# EAGLE design Gondola_Sail_electronics_M4_minimal (EAGLE 9.3.0)
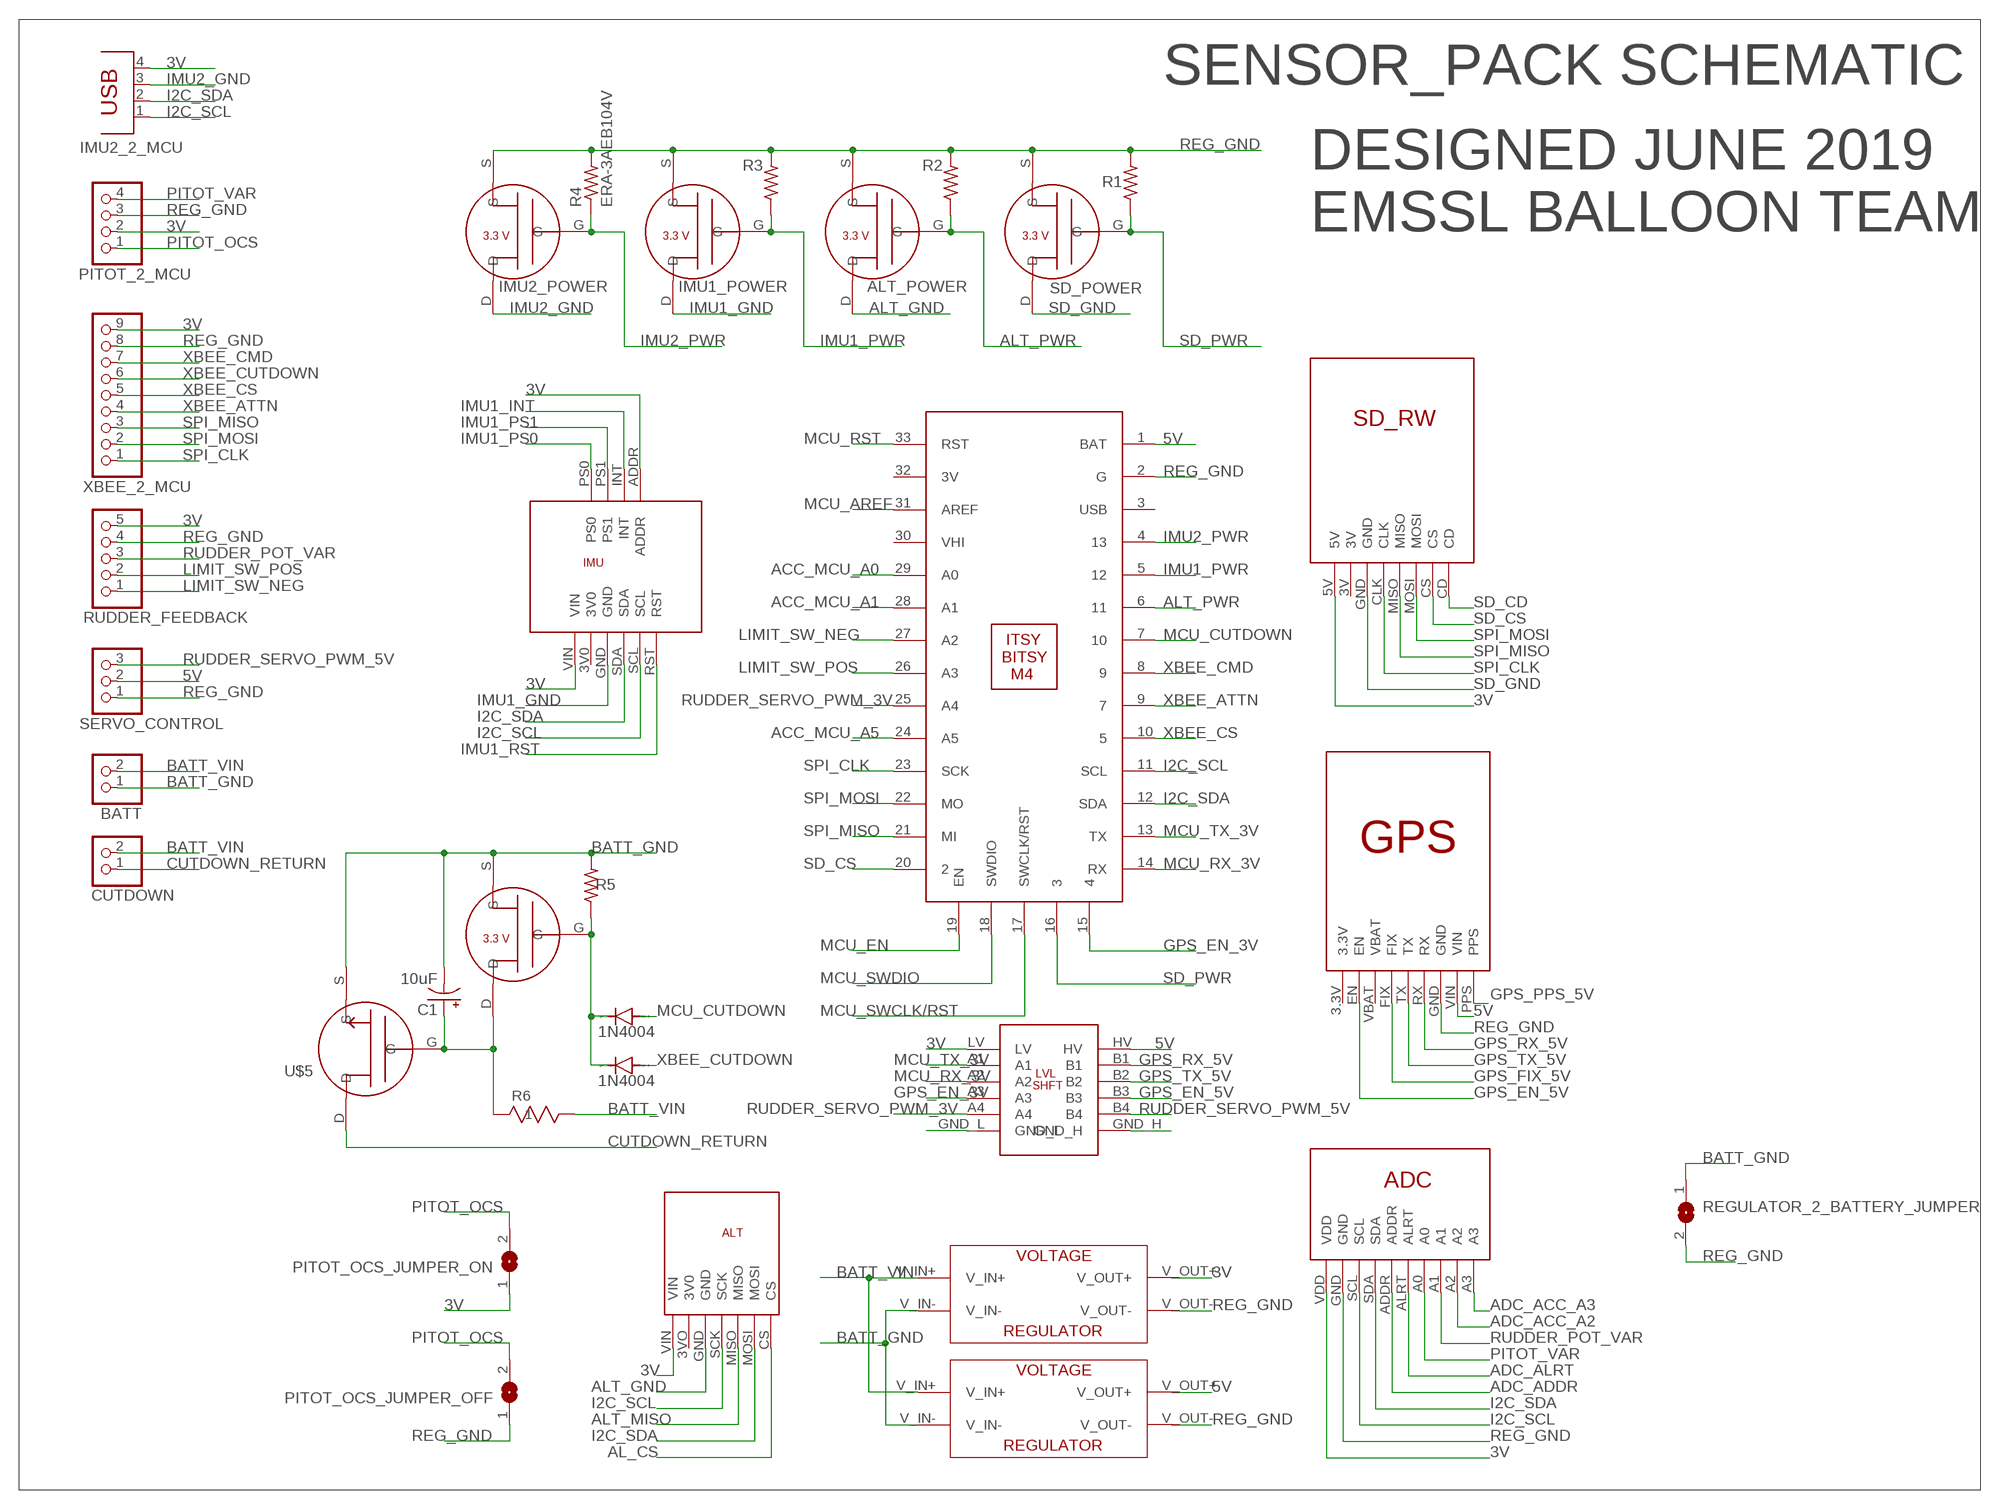
[diagram p0: schematic, sheet 1]

## Parts
3V_REG  3V/5V_REGULATOR  [5V/3V_REGULATOR]
5V_REG  3V/5V_REGULATOR  [5V/3V_REGULATOR]
ALT_POWER  3.3V_NCH_FET  [3.3VTRANSISTOR]
BATT  PINHD-1X2/90  [1X02/90]
C1  10uF  10UF-POLAR-RADIAL-2.5MM-25V-20%  [CPOL-RADIAL-2.5MM-5MM]
CUTDOWN  PINHD-1X2/90  [1X02/90]
D1  1N4004  [DO41-10]
D2  1N4004  [DO41-10]
IMU1  BNO055  [BNO055]
IMU1_POWER  3.3V_NCH_FET  [3.3VTRANSISTOR]
IMU2_2_MCU  PN87520  [PN87520]
IMU2_POWER  3.3V_NCH_FET  [3.3VTRANSISTOR]
PITOT_2_MCU  PINHD-1X4/90  [1X04/90]
PITOT_OCS_JUMPER_OFF  SJ  [SJ]
PITOT_OCS_JUMPER_ON  SJ  [SJ]
R1  ERA-3AEB104V  [RESC1608X55]
R2  ERA-3AEB104V  [RESC1608X55]
R3  ERA-3AEB104V  [RESC1608X55]
R4  ERA-3AEB104V  [RESC1608X55]
R5  ERA-3AEB104V  [RESC1608X55]
R6  RR0816P-103-D  [RES_0816]
REGULATOR_2_BATTERY_JUMPER  SJW  [SJW]
RUDDER_FEEDBACK  PINHD-1X5/90  [1X05/90]
SD_POWER  3.3V_NCH_FET  [3.3VTRANSISTOR]
SD_POWER1  3.3V_NCH_FET  [3.3VTRANSISTOR]
SERVO_CONTROL  PINHD-1X3/90  [1X03/90]
U$1  ADAFRUIT_GPS  [ADAFRUIT_GPS]
U$2  ADAFRUI_SD_RW  [ADAFRUIT_SD_RW]
U$3  ADS1115  [ADS1115]
U$4  BME280  [BME280]
U$5  CUTDOWN_POWER_TRANSISTOR  [T03B]
U$6  BSS138_LVLSHIFT  [BSS138_LEVELSHIFT]
U$8  ITSY_BITSY_M4  [ITSY_BITSY_M4]
XBEE_2_MCU  PINHD-1X9/90  [1X09/90]

## Nets
3V: 3V_REG.V_OUT+ IMU1.ADDR IMU1.VIN IMU2_2_MCU.4 PITOT_2_MCU.2 PITOT_OCS_JUMPER_ON.1 RUDDER_FEEDBACK.5 U$2.5V U$3.VDD U$4.VIN U$6.LV XBEE_2_MCU.9
5V: 5V_REG.V_OUT+ SERVO_CONTROL.2 U$1.VIN U$6.HV U$8.1(BAT)
ACC_MCU_A0: U$8.29(A0)
ACC_MCU_A1: U$8.28(A1)
ACC_MCU_A5: U$8.24(A5)
ADC_ACC_A2: U$3.A2
ADC_ACC_A3: U$3.A3
ADC_ADDR: U$3.ADDR
ADC_ALRT: U$3.ALRT
AL_CS: U$4.CS
ALT_GND: ALT_POWER.D U$4.GND
ALT_MISO: U$4.MISO
ALT_PWR: ALT_POWER.G R2.1 U$8.6
BATT_GND: 3V_REG.V_IN- 5V_REG.V_IN- BATT.1 C1.2(-) R5.2 REGULATOR_2_BATTERY_JUMPER.1 SD_POWER1.S U$5.S
BATT_VIN: 3V_REG.V_IN+ 5V_REG.V_IN+ BATT.2 CUTDOWN.2 R6.2
CUTDOWN: D1.C D2.C R5.1 SD_POWER1.G
CUTDOWN_RETURN: CUTDOWN.1 U$5.D
GPS_EN_3V: U$6.A3 U$8.15
GPS_EN_5V: U$1.EN U$6.B3
GPS_FIX_5V: U$1.FIX
GPS_PPS_5V: U$1.PPS
GPS_RX_5V: U$1.RX U$6.B1
GPS_TX_5V: U$1.TX U$6.B2
I2C_SCL: IMU1.SCL IMU2_2_MCU.1 U$3.SCL U$4.SCK U$8.11(SCL)
I2C_SDA: IMU1.SDA IMU2_2_MCU.2 U$3.SDA U$4.MOSI U$8.12(SDA)
IMU1_GND: IMU1.GND IMU1_POWER.D
IMU1_INT: IMU1.INT
IMU1_PS0: IMU1.PS0
IMU1_PS1: IMU1.PS1
IMU1_PWR: IMU1_POWER.G R3.1 U$8.5
IMU1_RST: IMU1.RST
IMU2_GND: IMU2_2_MCU.3 IMU2_POWER.D
IMU2_PWR: IMU2_POWER.G R4.1 U$8.4
LIMIT_SW_NEG: RUDDER_FEEDBACK.1 U$8.27(A2)
LIMIT_SW_POS: RUDDER_FEEDBACK.2 U$8.26(A3)
MCU_AREF: U$8.31(AREF)
MCU_CUTDOWN: D1.A U$8.7
MCU_EN: U$8.19(EN)
MCU_RST: U$8.33(RST)
MCU_RX_3V: U$6.A2 U$8.14(RX)
MCU_SWCLK/RST: U$8.17(SWCLK/RST)
MCU_SWDIO: U$8.18(SWDIO)
MCU_TX_3V: U$6.A1 U$8.13(TX)
N$1: U$6.GND_L
N$2: U$6.GND_H
N$5: C1.1(+) R6.1 SD_POWER1.D U$5.G
PITOT_OCS: PITOT_2_MCU.1 PITOT_OCS_JUMPER_OFF.2 PITOT_OCS_JUMPER_ON.2
PITOT_VAR: PITOT_2_MCU.4 U$3.A0
REG_GND: 3V_REG.V_OUT- 5V_REG.V_OUT- ALT_POWER.S IMU1_POWER.S IMU2_POWER.S PITOT_2_MCU.3 PITOT_OCS_JUMPER_OFF.1 R1.2 R2.2 R3.2 R4.2 REGULATOR_2_BATTERY_JUMPER.2 RUDDER_FEEDBACK.4 SD_POWER.S SERVO_CONTROL.1 U$1.GND U$3.GND U$8.2(G) XBEE_2_MCU.8
RUDDER_POT_VAR: RUDDER_FEEDBACK.3 U$3.A1
RUDDER_SERVO_PWM_3V: U$6.A4 U$8.25(A4)
RUDDER_SERVO_PWM_5V: SERVO_CONTROL.3 U$6.B4
SD_CD: U$2.CD
SD_CS: U$2.CS U$8.20
SD_GND: SD_POWER.D U$2.GND
SD_PWR: R1.1 SD_POWER.G U$8.16
SPI_CLK: U$2.CLK U$8.23(SCK) XBEE_2_MCU.1
SPI_MISO: U$2.MISO U$8.21(MI) XBEE_2_MCU.3
SPI_MOSI: U$2.MOSI U$8.22(MO) XBEE_2_MCU.2
XBEE_ATTN: U$8.9 XBEE_2_MCU.4
XBEE_CMD: U$8.8 XBEE_2_MCU.7
XBEE_CS: U$8.10 XBEE_2_MCU.5
XBEE_CUTDOWN: D2.A XBEE_2_MCU.6
Unconnected: IMU1.3V0 U$1.3.3V U$1.VBAT U$2.3V U$4.3VO(3V0) U$8.3(USB) U$8.30(VHI) U$8.32(3V)

## Notes on the sheet
- SENSOR_PACK SCHEMATIC
- DESIGNED JUNE 2019
  EMSSL BALLOON TEAM

## Library data of the parts
3V_REG 5V_REG = Adafruit_Arduino:3V/5V_REGULATOR
ALT_POWER IMU1_POWER IMU2_POWER SD_POWER SD_POWER1 = Adafruit_Arduino:3.3V_NCH_FET
BATT CUTDOWN = pinhead:PINHD-1X2: PIN HEADER
C1 = SparkFun-Capacitors:10UF-POLAR: 10.0µF polarized capacitors A capacitor is a passive two-terminal electrical component used to store electrical energy temporarily in an electric field.; PROD_ID: CAP-08440
D1 D2 = diode:1N4004: DIODE general purpose rectifier, 1 A
IMU1 = Adafruit_Arduino:BNO055
IMU2_2_MCU = con-berg:PN87520: BERG USB connector; OC_FARNELL: unknown; OC_NEWARK: unknown
PITOT_2_MCU = pinhead:PINHD-1X4: PIN HEADER
PITOT_OCS_JUMPER_OFF PITOT_OCS_JUMPER_ON REGULATOR_2_BATTERY_JUMPER = jumper:SJ: SMD solder JUMPER
R1-R5 = ERA-3AEB104V:ERA-3AEB104V: METAL FILM RESISTOR, 100KOHM, 100mW, 0.1%; DESCRIPTION: Res Thin Film 0603 100K Ohm 0.1% 0.1W_1/10W_ Ø¢±25ppm/Ø¢°C Molded SMD Automotive Punched T/R; DIGI-KEY_PART_NUMBER: P100KDBCT-ND; DIGI-KEY_PURCHASE_URL: https://www.digikey.com/product-detail/en/panasonic-electronic-components/ERA-3AEB104V/P100KDBCT-ND/1466100?utm_source=snapeda&utm_medium=aggregator&utm_campaign=symbol; MF: Panasonic; MP: ERA-3AEB104V; PACKAGE: 0603 Panasonic
R6 = 10K_SMD_resistors_RR0816p-103-D:RR0816P-103-D; MANUFACTURER_PART_NUMBER: RR0816P103D; VENDOR: Susumu
RUDDER_FEEDBACK = pinhead:PINHD-1X5: PIN HEADER
SERVO_CONTROL = pinhead:PINHD-1X3: PIN HEADER
U$1 = Adafruit_Arduino:ADAFRUIT_GPS
U$2 = Adafruit_Arduino:ADAFRUI_SD_RW
U$3 = Adafruit_Arduino:ADS1115
U$4 = Adafruit_Arduino:BME280
U$5 = Ultrasonic Misc PieceParts:CUTDOWN_POWER_TRANSISTOR
U$6 = Adafruit_Arduino:BSS138_LVLSHIFT
U$8 = Adafruit_Arduino:ITSY_BITSY_M4
XBEE_2_MCU = pinhead:PINHD-1X9: PIN HEADER

## Board
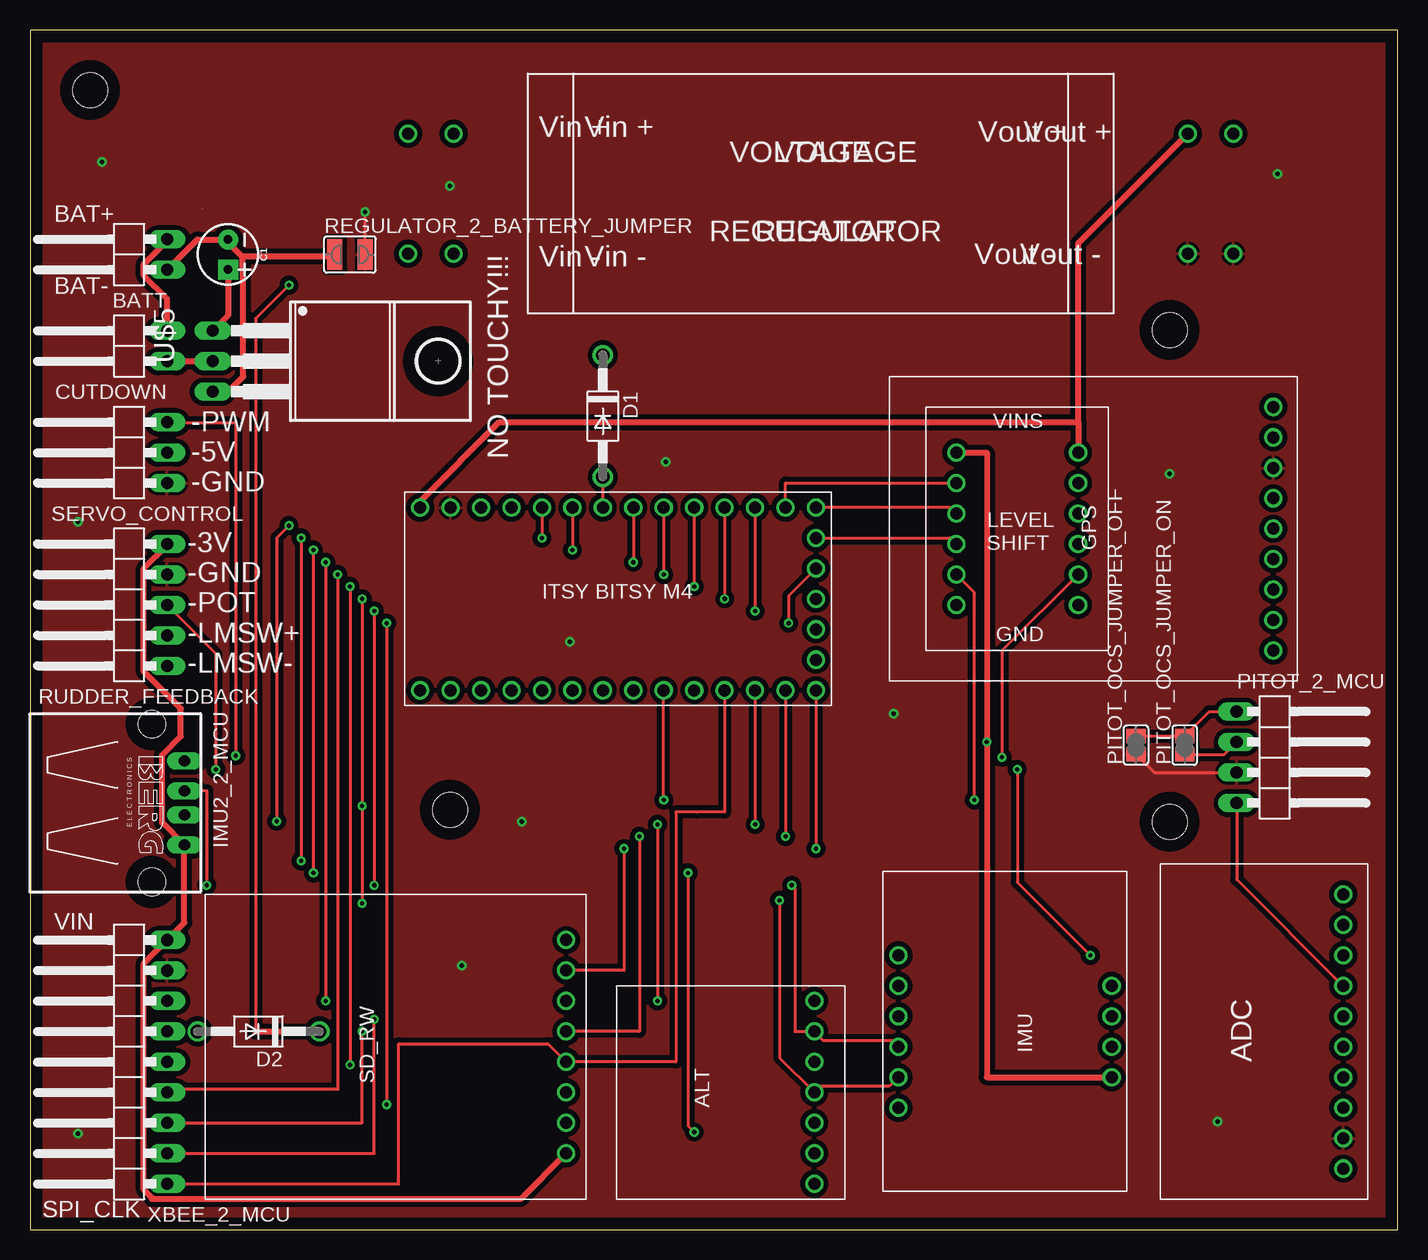
[diagram p1: board, top side]
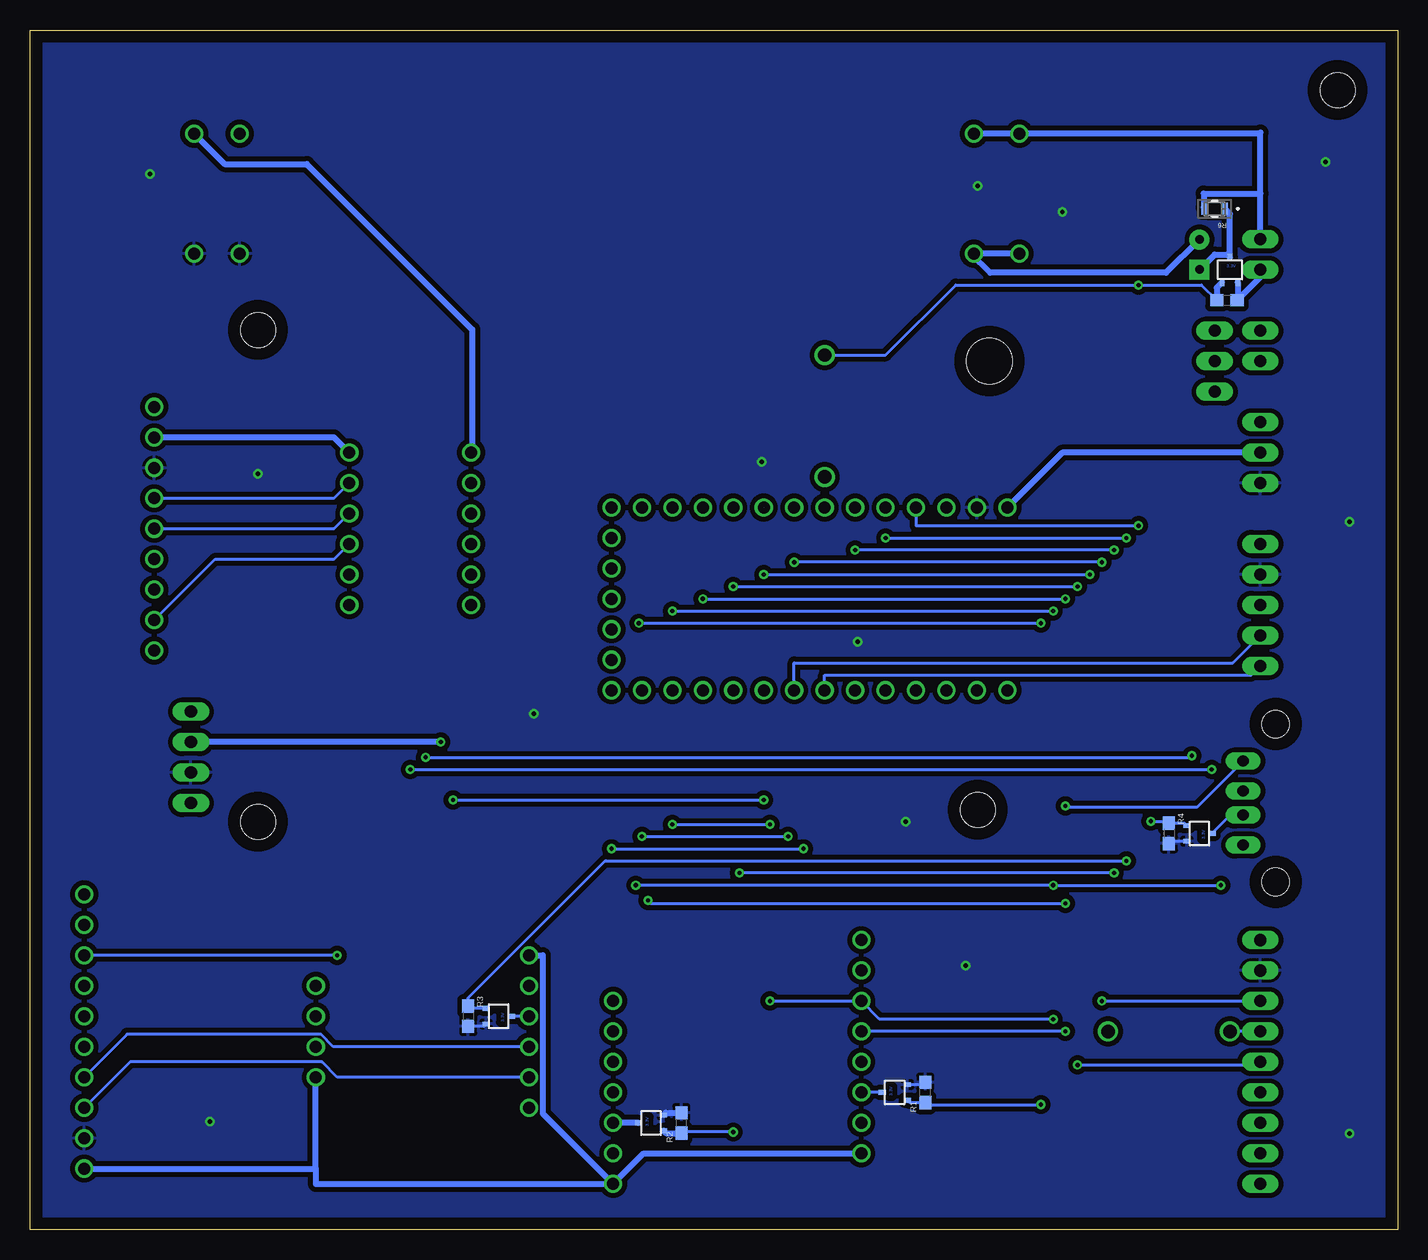
[diagram p2: board, bottom side, seen from below]

Size 114 x 100 mm. Coordinates in mm from the lower left corner, seen from the top.
Outline: 0,0 114,0 114,100 0,100 0,0
Copper layers (1*16): Top 0.035mm / dielectric 1.5mm / Bottom 0.035mm
Design rules "default": minimum track width 6mil, minimum drill 0.35mm, track to track 6mil, track to pad 6mil, pad to pad 6mil, via to via 6mil, smd to smd 6mil, copper to edge 40mil, drill to drill 6mil, minimum pad ring 10mil, minimum via ring 8mil, stop-mask expansion 4mil, vias tented up to drill 0mil, thermal gap 10mil
Holes 2.9 mm at 5,95 95,75 35,35 95,34

### Footprints (pad centres in the part's own frame; a part is rotated, then mirrored left to right if it is on the bottom)
5V/3V_REGULATOR = drill 1: V_IN+ -32.5,5; V_IN- -32.5,-5; V_OUT+ 32.5,5; V_OUT- 32.5,-5
3.3VTRANSISTOR = smd 0.4 x 0.6: D 0,1.05; G -0.65,-1.05; S 0.65,-1.05
1X02/90 = drill 1.016 long: 1 -1.27,-3.81; 2 1.27,-3.81
CPOL-RADIAL-2.5MM-5MM = drill 0.7 pad 1.651 square: 1 1.25,0 | drill 0.7 pad 1.651: 2 -1.25,0
DO41-10 = drill 1.118: A 5.08,0; C -5.08,0
BNO055 = drill 1: 3V0 -3.81,-8.89; ADDR 3.81,8.89; GND -1.27,-8.89; INT 1.27,8.89; PS0 -3.81,8.89; PS1 -1.27,8.89; RST 6.35,-8.89; SCL 3.81,-8.89; SDA 1.27,-8.89; VIN -6.35,-8.89
PN87520 = drill 0.95 long: 1 -3.5,2.71; 2 -1,2.71; 3 1,2.71; 4 3.5,2.71 | hole 2.3: -6.57,0; 6.57,0
1X04/90 = drill 1.016 long: 1 -3.81,-3.81; 2 -1.27,-3.81; 3 1.27,-3.81; 4 3.81,-3.81
SJ = smd 1.168 x 1.6: 1 -0.762,0; 2 0.762,0
RESC1608X55 = smd 1.1 x 1: 1 -0.85,0; 2 0.85,0
RES_0816 = smd 0.553 x 1: 1 -0.827,0; 2 0.827,0
SJW = smd 1.27 x 2.54: 1 -1.27,0; 2 1.27,0
1X05/90 = drill 1.016 long: 1 -5.08,-3.81; 2 -2.54,-3.81; 3 0,-3.81; 4 2.54,-3.81; 5 5.08,-3.81
1X03/90 = drill 1.016 long: 1 -2.54,-3.81; 2 0,-3.81; 3 2.54,-3.81
ADAFRUIT_GPS = drill 1: 3.3V -10.16,-14.986; EN -7.62,-14.986; FIX -2.54,-14.986; GND 5.08,-14.986; PPS 10.16,-14.986; RX 2.54,-14.986; TX 0,-14.986; VBAT -5.08,-14.986; VIN 7.62,-14.986
ADAFRUIT_SD_RW = drill 1: 3V -6.35,-14.224; 5V -8.89,-14.224; CD 8.89,-14.224; CLK -1.27,-14.224; CS 6.35,-14.224; GND -3.81,-14.224; MISO 1.27,-14.224; MOSI 3.81,-14.224
ADS1115 = drill 1: A0 3.81,-6.604; A1 6.35,-6.604; A2 8.89,-6.604; A3 11.43,-6.604; ADDR -1.27,-6.604; ALRT 1.27,-6.604; GND -8.89,-6.604; SCL -6.35,-6.604; SDA -3.81,-6.604; VDD -11.43,-6.604
BME280 = drill 1: 3VO -5.08,-6.96; CS 7.62,-6.96; GND -2.54,-6.96; MISO 2.54,-6.96; MOSI 5.08,-6.96; SCK 0,-6.96; VIN -7.62,-6.96
T03B = drill 1.016 long: D 0,-11.43; G -2.54,-11.43; S 2.54,-11.43 | hole 3.81: 0,7.366
BSS138_LEVELSHIFT = drill 1: A1 -5.08,3.81; A2 -5.08,1.27; A3 -5.08,-1.27; A4 -5.08,-3.81; B1 5.08,3.81; B2 5.08,1.27; B3 5.08,-1.27; B4 5.08,-3.81; GND_H 5.08,-6.35; GND_L -5.08,-6.35; HV 5.08,6.35; LV -5.08,6.35
ITSY_BITSY_M4 = drill 1: 1 -16.51,7.62; 2 -13.97,7.62; 3 -11.43,7.62; 4 -8.89,7.62; 5 -6.35,7.62; 6 -3.81,7.62; 7 -1.27,7.62; 8 1.27,7.62; 9 3.81,7.62; 10 6.35,7.62; 11 8.89,7.62; 12 11.43,7.62; 13 13.97,7.62; 14 16.51,7.62; 15 16.51,5.08; 16 16.51,2.54; 17 16.51,0; 18 16.51,-2.54; 19 16.51,-5.08; 20 16.51,-7.62; 21 13.97,-7.62; 22 11.43,-7.62; 23 8.89,-7.62; 24 6.35,-7.62; 25 3.81,-7.62; 26 1.27,-7.62; 27 -1.27,-7.62; 28 -3.81,-7.62; 29 -6.35,-7.62; 30 -8.89,-7.62; 31 -11.43,-7.62; 32 -13.97,-7.62; 33 -16.51,-7.62
1X09/90 = drill 1.016 long: 1 -10.16,-3.81; 2 -7.62,-3.81; 3 -5.08,-3.81; 4 -2.54,-3.81; 5 0,-3.81; 6 2.54,-3.81; 7 5.08,-3.81; 8 7.62,-3.81; 9 10.16,-3.81

### Placement (x,y rotation side)
3V_REG  67.82,86.36 0 top
5V_REG  64.01,86.36 0 top
ALT_POWER  62.23,8.89 90 bottom
BATT  7.62,81.28 90 top
C1  16.51,81.28 270 top
CUTDOWN  7.62,73.66 90 top
D1  47.75,67.82 270 top
D2  19.05,16.51 180 top
IMU1  81.28,16.51 270 top
IMU1_POWER  74.93,17.78 270 bottom
IMU2_2_MCU  10.16,35.56 270 top
IMU2_POWER  16.51,33.02 270 bottom
PITOT_2_MCU  104.39,39.37 270 top
PITOT_OCS_JUMPER_OFF  92.2,40.39 90 top
PITOT_OCS_JUMPER_ON  96.27,40.39 90 top
R1  39.37,11.43 90 bottom
R2  59.69,8.89 90 bottom
R3  77.47,17.78 270 bottom
R4  19.05,33.02 270 bottom
R5  14.22,77.47 0 bottom
R6  15.24,85.09 180 bottom
REGULATOR_2_BATTERY_JUMPER  26.67,81.28 0 top
RUDDER_FEEDBACK  7.62,52.07 90 top
SD_POWER  41.91,11.43 90 bottom
SD_POWER1  13.97,80.01 0 bottom
SERVO_CONTROL  7.62,64.77 90 top
U$1  88.65,58.42 90 top
U$2  30.48,15.24 90 top
U$3  102.87,16.51 90 top
U$4  58.42,11.43 90 top
U$5  26.67,72.39 270 top
U$6  82.3,58.42 0 top
U$8  49.02,52.58 0 top
XBEE_2_MCU  7.62,13.97 90 top

### Tracks (layer width: path | path; a pad name or v marks a point on that pad's centre or on a via)
3V  (via drill 0.35)
  Top 0.254: PITOT_OCS_JUMPER_ON.1 99.57,39.62 PITOT_2_MCU.2
  Top 0.508: U$6.LV 79.76,64.77 v79.76,40.64 79.76,12.7 IMU1.ADDR | U$2.5V 40.89,2.54 10.16,2.54 10.16,2.67 9.5,3.33 9.5,22.2 XBEE_2_MCU.9 12.87,25.57 IMU2_2_MCU.4 11.01,33.92 11.01,39.55 12.58,41.13 12.58,43.43 9.5,46.51 9.5,55.09 11.43,57.02 RUDDER_FEEDBACK.5
  Bottom 0.254: 77.14,64.69 U$6.LV
  Bottom 0.508: v79.76,40.64 PITOT_2_MCU.2 | U$3.VDD 90.17,5.08 | 90.17,5.08 90.17,3.81 U$4.VIN | 90.17,5.08 IMU1.ADDR | 66.65,5.08 U$4.VIN | U$4.VIN 71.23,9.66 71.23,22.86 IMU1.VIN | U$4.VIN 62.84,6.35 U$2.5V | 3V_REG.V_OUT+ 97.78,88.82 90.92,88.82 77.14,75.04 77.14,64.69
5V
  Top 0.508: U$8.1 32.51,60.71 39.12,67.31 87.38,67.31 | 87.38,67.31 87.38,82.23 5V_REG.V_OUT+ | 87.38,67.31 U$6.HV
  Bottom 0.508: U$6.HV 88.65,66.04 U$1.VIN | SERVO_CONTROL.2 27.94,64.77 U$8.1
ALT_GND
  Bottom 0.508: ALT_POWER.D U$4.GND
ALT_PWR  (via drill 0.35)
  Top 0.254: U$8.6 v45.21,56.64 | v23.62,56.64 v23.62,29.72 | v54.86,29.72 54.86,8.64 v55.37,8.13
  Bottom 0.254: v23.62,29.72 v54.86,29.72 | v55.37,8.13 59.6,8.13 R2.1 | v23.62,56.64 v45.21,56.64
  Bottom 0.508: ALT_POWER.G 60.98,8.04 R2.1
BATT_GND
  Top 0.508: BATT.1 13.95,82.53 C1.2 16.51,82.26 17.63,81.13 | U$5.S 16.51,69.85 17.78,71.12 17.78,79.99 17.74,80.03 17.74,81.02 17.63,81.13 | 17.63,81.13 25.25,81.13 REGULATOR_2_BATTERY_JUMPER.1
  Bottom 0.508: 5V_REG.V_IN- 3V_REG.V_IN- 35.56,81.36 33.96,79.76 19.3,79.76 16.53,82.53 C1.2 | SD_POWER1.S 13.32,77.52 R5.2 11.43,79.41 BATT.1
BATT_VIN
  Top 0.508: CUTDOWN.2 11.43,77.6 9.5,79.53 9.5,80.49 11.43,82.42 BATT.2
  Bottom 0.508: BATT.2 11.43,86.36 | 11.43,86.36 11.43,91.44 11.51,91.36 5V_REG.V_IN+ 3V_REG.V_IN+ | R6.2 16.17,85.19 16.17,86.36 11.43,86.36
CUTDOWN  (via drill 0.35)
  Top 0.254: v21.59,78.74 18.8,75.95 18.8,16.51
  Top 0.508: 18.8,16.51 D2.C
  Bottom 0.254: R5.1 16.34,78.74 v21.59,78.74 36.83,78.74 42.67,72.9 D1.C
  Bottom 0.508: SD_POWER1.G 15.07,78.51 R5.1
CUTDOWN_RETURN
  Top 0.508: CUTDOWN.1 U$5.D
GPS_EN_3V
  Top 0.254: U$6.A3 76.71,57.66 U$8.15
GPS_EN_5V
  Bottom 0.254: U$1.EN 98.55,55.88 88.65,55.88 U$6.B3
GPS_RX_5V
  Bottom 0.254: U$1.RX 88.65,60.96 U$6.B1
GPS_TX_5V
  Bottom 0.254: U$1.TX 88.65,58.42 U$6.B2
I2C_SCL  (via drill 0.35)
  Top 0.254: U$8.11 v57.91,52.58 | IMU1.SCL 71.63,11.94 65.89,11.94 U$4.SCK 62.48,14.33 v62.48,27.43 | v27.69,52.58 v27.69,35.31 v27.69,27.18
  Bottom 0.254: IMU1.SCL 88.39,12.7 89.66,13.97 105.66,13.97 U$3.SCL | v27.69,27.18 62.23,27.18 v62.48,27.43 | IMU2_2_MCU.1 16.68,35.25 27.63,35.25 v27.69,35.31 | v57.91,52.58 v27.69,52.58
I2C_SDA  (via drill 0.35)  (1 unrouted)
  Top 0.254: U$8.12 v60.45,51.56 | IMU1.SDA 71.88,15.75 66.14,15.75 U$4.MOSI 63.75,16.51 63.75,28.45 v63.5,28.7 | v28.7,51.56 v28.7,28.7 | v14.73,28.7 14.73,36.58 12.89,36.58 IMU2_2_MCU.2
  Bottom 0.254: IMU1.SDA 88.71,15.24 89.74,16.27 105.9,16.27 U$3.SDA | v63.5,28.7 v28.7,28.7 v14.73,28.7 | v60.45,51.56 v28.7,51.56
IMU1_GND
  Bottom 0.254: IMU1.GND IMU1_POWER.D
IMU1_PWR  (via drill 0.35)
  Top 0.254: U$8.5 v42.67,57.66 | v22.61,57.66 v22.61,30.73
  Bottom 0.254: IMU1_POWER.G 77.27,18.43 R3.1 77.47,19.3 66.01,30.77 66.01,30.73 v22.61,30.73 | v42.67,57.66 v22.61,57.66
IMU2_GND
  Bottom 0.254: IMU2_POWER.D 13.92,34.56 IMU2_2_MCU.3
IMU2_PWR  (via drill 0.35)
  Top 0.254: v21.59,58.67 20.57,57.66 v20.57,34.04
  Bottom 0.254: U$8.4 40.13,58.67 v21.59,58.67 | IMU2_POWER.G 17.76,33.87 R4.1 19.22,34.04 v20.57,34.04
LIMIT_SW_NEG
  Bottom 0.254: U$8.27 47.75,46.23 12.19,46.23 RUDDER_FEEDBACK.1
LIMIT_SW_POS
  Bottom 0.254: U$8.26 50.29,47.24 13.72,47.24 RUDDER_FEEDBACK.2
MCU_CUTDOWN
  Top 0.254: U$8.7 D1.A
MCU_RX_3V
  Top 0.254: U$8.14 67.3,60.2 68.58,60.2 76.71,60.2 U$6.A2
MCU_TX_3V
  Top 0.254: U$8.13 62.99,62.23 U$6.A1
N$5  (1 unrouted)
  Top 0.508: C1.1 16.51,76.2 U$5.G
  Bottom 0.508: C1.1 16.49,80.03 15.24,81.28 14.19,81.28 SD_POWER1.D 13.97,84.65 R6.1
PITOT_OCS
  Top 0.254: PITOT_OCS_JUMPER_OFF.2 PITOT_OCS_JUMPER_ON.2 98.3,43.18 PITOT_2_MCU.1
PITOT_VAR
  Top 0.254: U$3.A0 109.44,20.32 100.58,29.17 PITOT_2_MCU.4
REG_GND  (via drill 0.35)
  Top 0.254: REGULATOR_2_BATTERY_JUMPER.2 v27.94,84.84 | PITOT_OCS_JUMPER_OFF.1 93.73,38.1 PITOT_2_MCU.3
  Bottom 0.254: IMU1_POWER.S 76.18,16.93 R3.2 | R1.2 39.57,12.08 SD_POWER.S | IMU2_POWER.S 18.85,32.37 R4.2
  Bottom 0.508: ALT_POWER.S 60.98,9.74 R2.2
  other vias: 4,8 36,22 4,59 6,89 35,87 53,64 45,49 41,34 99,9 72,43 95,63 104,88
  pour Bottom (isolate 0.406): 0,0 0,100 114,100 114,0
  pour Top (isolate 0.406): 0,0 0,100 114,100 114,0
RUDDER_POT_VAR  (via drill 0.35)
  Top 0.254: RUDDER_FEEDBACK.3 15.49,48.01 v15.49,38.35 | v82.3,38.35 82.3,28.96 v88.39,22.86
  Bottom 0.254: v82.3,38.35 v15.49,38.35 | v88.39,22.86 U$3.A1
RUDDER_SERVO_PWM_3V  (via drill 0.35)
  Top 0.254: v78.74,35.81 78.74,53.09 U$6.A4 | v52.83,35.81 U$8.25
  Bottom 0.254: v78.74,35.81 v52.83,35.81
RUDDER_SERVO_PWM_5V  (via drill 0.35)
  Top 0.254: v17.14,39.5 17.14,67.27 11.47,67.27 SERVO_CONTROL.3 | U$6.B4 81.03,48.26 v81.03,39.37
  Bottom 0.254: v81.03,39.37 17.27,39.37 v17.14,39.5
SD_CS  (via drill 0.35)
  Top 0.254: v65.53,31.75 65.53,43.69 65.53,43.94 U$8.20 | v49.53,31.75 49.53,21.59 U$2.CS
  Bottom 0.254: v65.53,31.75 v49.53,31.75
SD_GND
  Bottom 0.254: SD_POWER.D U$2.GND
SD_PWR  (via drill 0.35)
  Top 0.254: U$8.16 63.25,52.83 v63.25,50.55 | v29.72,50.55 v29.72,10.41
  Bottom 0.254: SD_POWER.G 40.66,10.58 R1.1 39.2,10.41 v29.72,10.41 | v63.25,50.55 v29.72,50.55
SPI_CLK
  Top 0.254: XBEE_2_MCU.1 30.73,3.81 30.73,15.49 43.18,15.49 U$2.CLK 53.85,13.97 53.85,34.8 55.6,34.8 57.91,34.8 57.91,43.94 57.91,44.2 U$8.23
SPI_MISO  (via drill 0.35)
  Top 0.254: v62.99,32.77 62.99,43.69 62.99,43.94 U$8.21 | v50.8,32.77 50.8,16.51 U$2.MISO | XBEE_2_MCU.3 27.69,8.89 v27.69,16.51
  Bottom 0.254: v62.99,32.77 v50.8,32.77 | v27.69,16.51 U$2.MISO
SPI_MOSI  (via drill 0.35)
  Top 0.254: v60.45,33.78 60.45,43.94 60.45,44.2 U$8.22 | v52.32,33.78 v52.32,19.05 | XBEE_2_MCU.2 28.7,6.35 v28.7,17.53
  Bottom 0.254: v60.45,33.78 v52.32,33.78 | v52.32,19.05 U$2.MOSI 43.18,17.53 v28.7,17.53
XBEE_ATTN  (via drill 0.35)  (2 unrouted)
  Top 0.254: U$8.9 v52.83,54.61 | v25.65,54.61 25.65,11.68 11.68,11.68 XBEE_2_MCU.4
  Bottom 0.254: v52.83,54.61 v25.65,54.61
XBEE_CMD  (via drill 0.35)
  Top 0.254: U$8.8 v50.29,55.63 | v24.64,55.63 v24.64,19.05
  Bottom 0.254: v24.64,19.05 XBEE_2_MCU.7 | v24.64,55.63 v50.29,55.63
XBEE_CS  (via drill 0.35)
  Top 0.254: U$8.10 v55.37,53.59 | v26.67,53.59 v26.67,13.72
  Bottom 0.254: v55.37,53.59 v26.67,53.59 | v26.67,13.72 11.68,13.72 XBEE_2_MCU.5
XBEE_CUTDOWN
  Bottom 0.254: XBEE_2_MCU.6 D2.A

### Text on the board
tPlace: BAT+ | BAT- | -PWM / -5V / -GND | -3V / -GND / -POT / -LMSW+ / -LMSW- | VIN | SPI_CLK